# EAGLE schematic I2C_IR (EAGLE 6.3)
DATABASE: ./../../eagle/PARTSDB.TXT
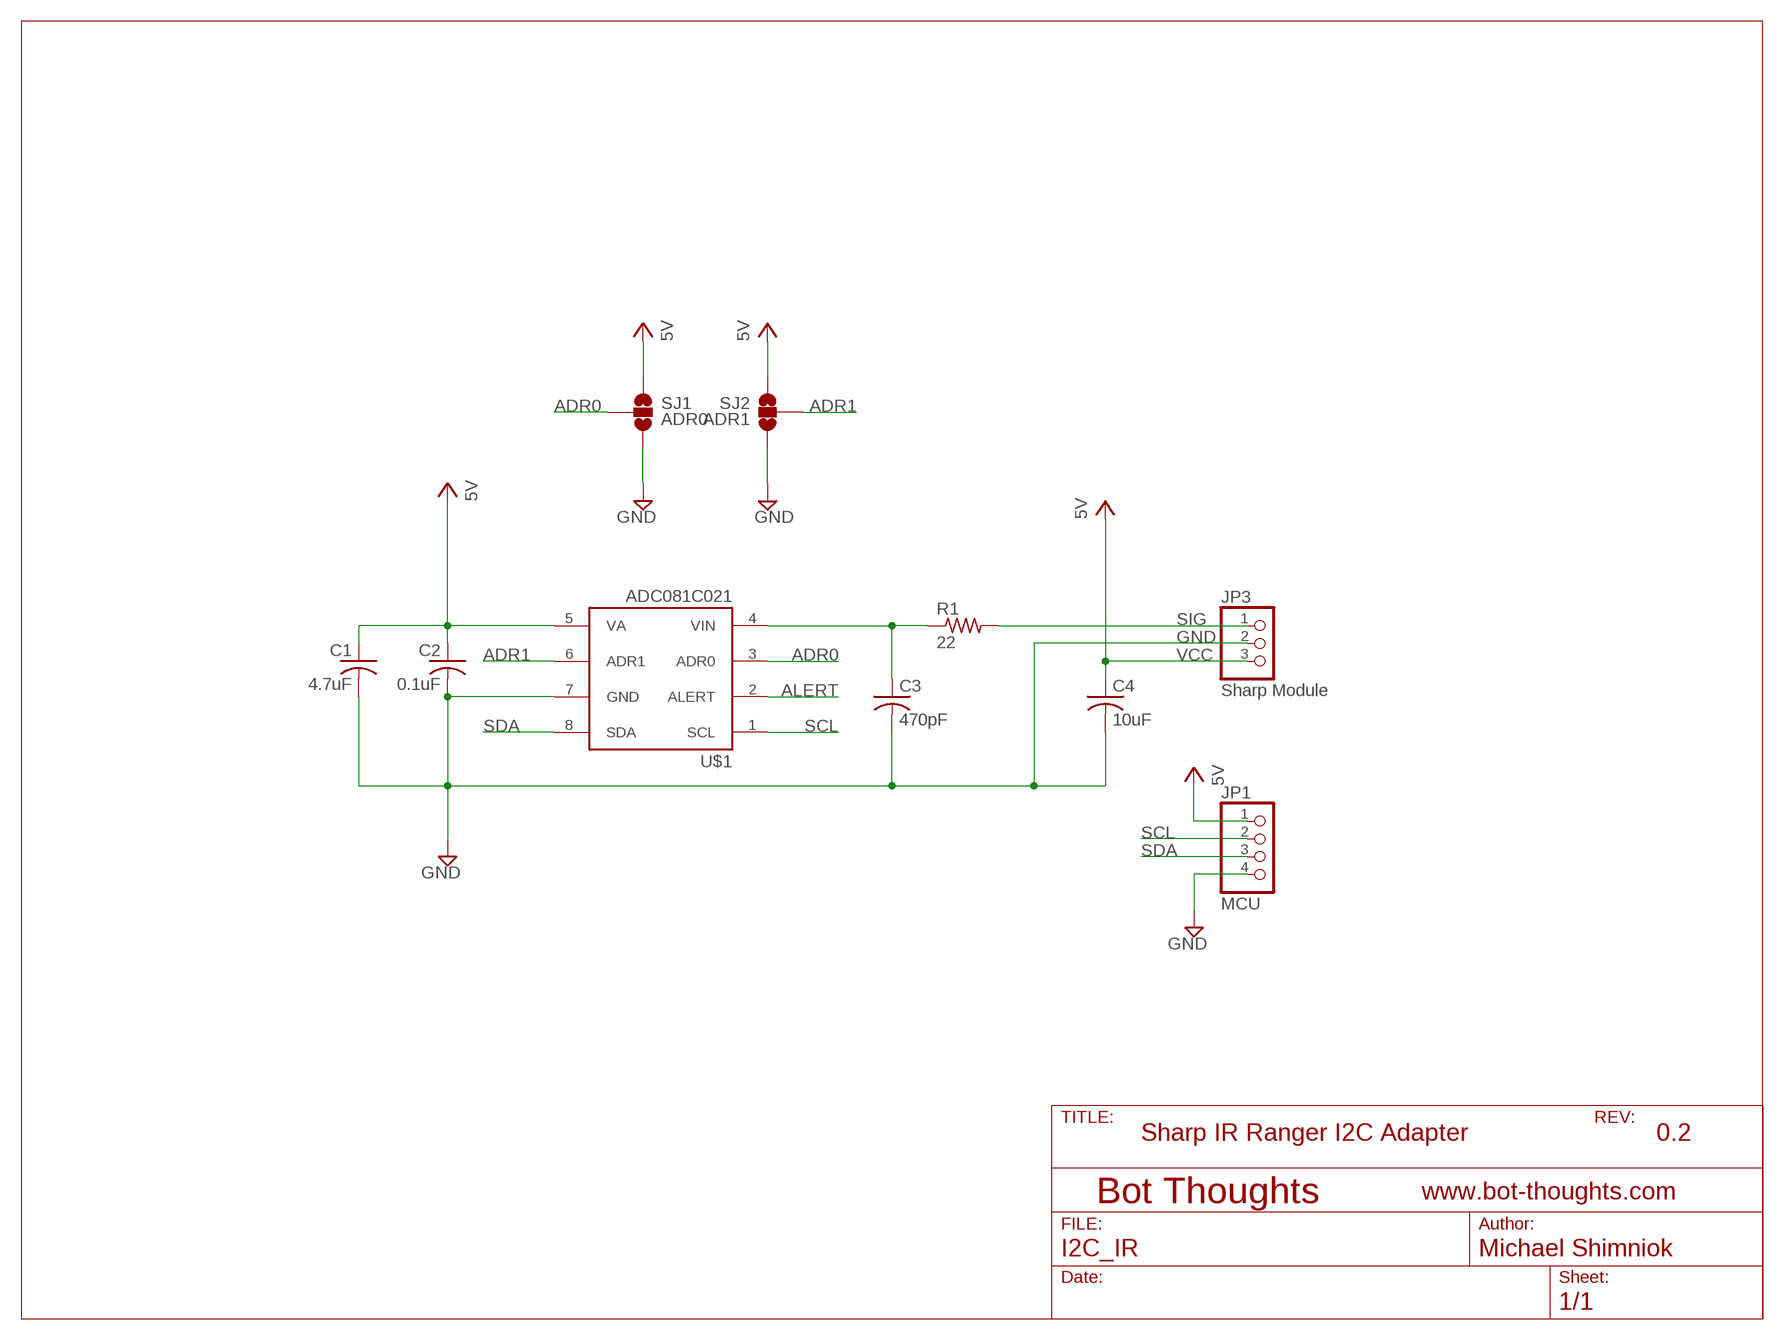
[diagram p0: schematic, sheet 1]

## Parts
C1  4.7uF  C-USC0603  [C0603]
C2  0.1uF  C-USC0603  [C0603]
C3  470pF  C-USC0603  [C0603]
C4  10uF  C-USC0603  [C0603]
JP1  MCU  PINHD-1X04_2.54-S  [1X04-S]
JP3  Sharp Module  PINHD-1X03_2.00  [1X03M]
R1  22  R-US_R0603  [R0603]
SJ1  ADR0  SOLDERJUMPER_2WAYS  [SJ_3]
SJ2  ADR1  SOLDERJUMPER_2WAYS  [SJ_3]
U$1  ADC081C021  [MSOP8_0.65]

## Nets
ADR0: SJ1.2 U$1.3(ADR0)
ADR1: SJ2.2 U$1.6(ADR1)
ALERT: U$1.2(ALERT)
GND: C1.2 C2.2 C3.2 C4.2 JP1.4 JP3.2 SJ1.3 SJ2.3 U$1.7(GND)
N$4: C3.1 R1.1 U$1.4(VIN)
SCL: JP1.2 U$1.1(SCL)
SDA: JP1.3 U$1.8(SDA)
SIG: JP3.1 R1.2
VCC: C1.1 C2.1 C4.1 JP1.1 JP3.3 SJ1.1 SJ2.1 U$1.5(VA) ; supply symbol labelled 5V

## Notes on the sheet
- Sharp IR Ranger I2C Adapter | 0.2

## Library data of the parts
C1-C4 = rcl:C-US: CAPACITOR, American symbol
JP1 = pinhead-2:PINHD-1X04: PIN HEADER
JP3 = pinhead-2:PINHD-1X03: PIN HEADER
R1 = rcl:R-US_: RESISTOR, American symbol
SJ1 SJ2 = SparkFun:SOLDERJUMPER_2WAY: Solder Jumper 2 way solder jumper
U$1 = mes_adc:ADC081C021: ADC081C021 / ADC101C021 / ADC121C021 National Semiconductor I2C Analog to Digital Converter. 8-pin version. 6-pin variants either have single address line or alert line